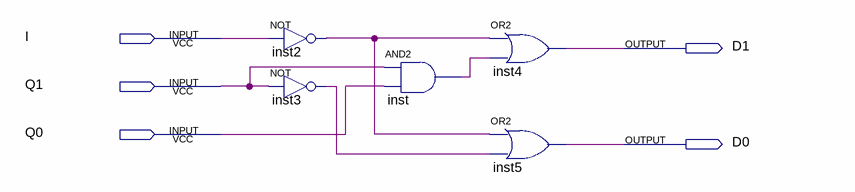
[diagram p0: schematic sheet]
// Quartus schematic NEXTSTATE.bdf as structural Verilog: 5 symbols, 5 pins
module NEXTSTATE (
  input  I,
  input  Q1,
  input  Q0,
  output D1,
  output D0
);

  wire inst2_out, inst3_out, inst_out;

  not inst2 (inst2_out, I);
  not inst3 (inst3_out, Q1);
  and inst (inst_out, Q1, Q0);
  or inst4 (D1, inst2_out, inst_out);
  or inst5 (D0, inst2_out, inst3_out);
endmodule
